# EAGLE schematic GuitarTuner (EAGLE 9.6.2)
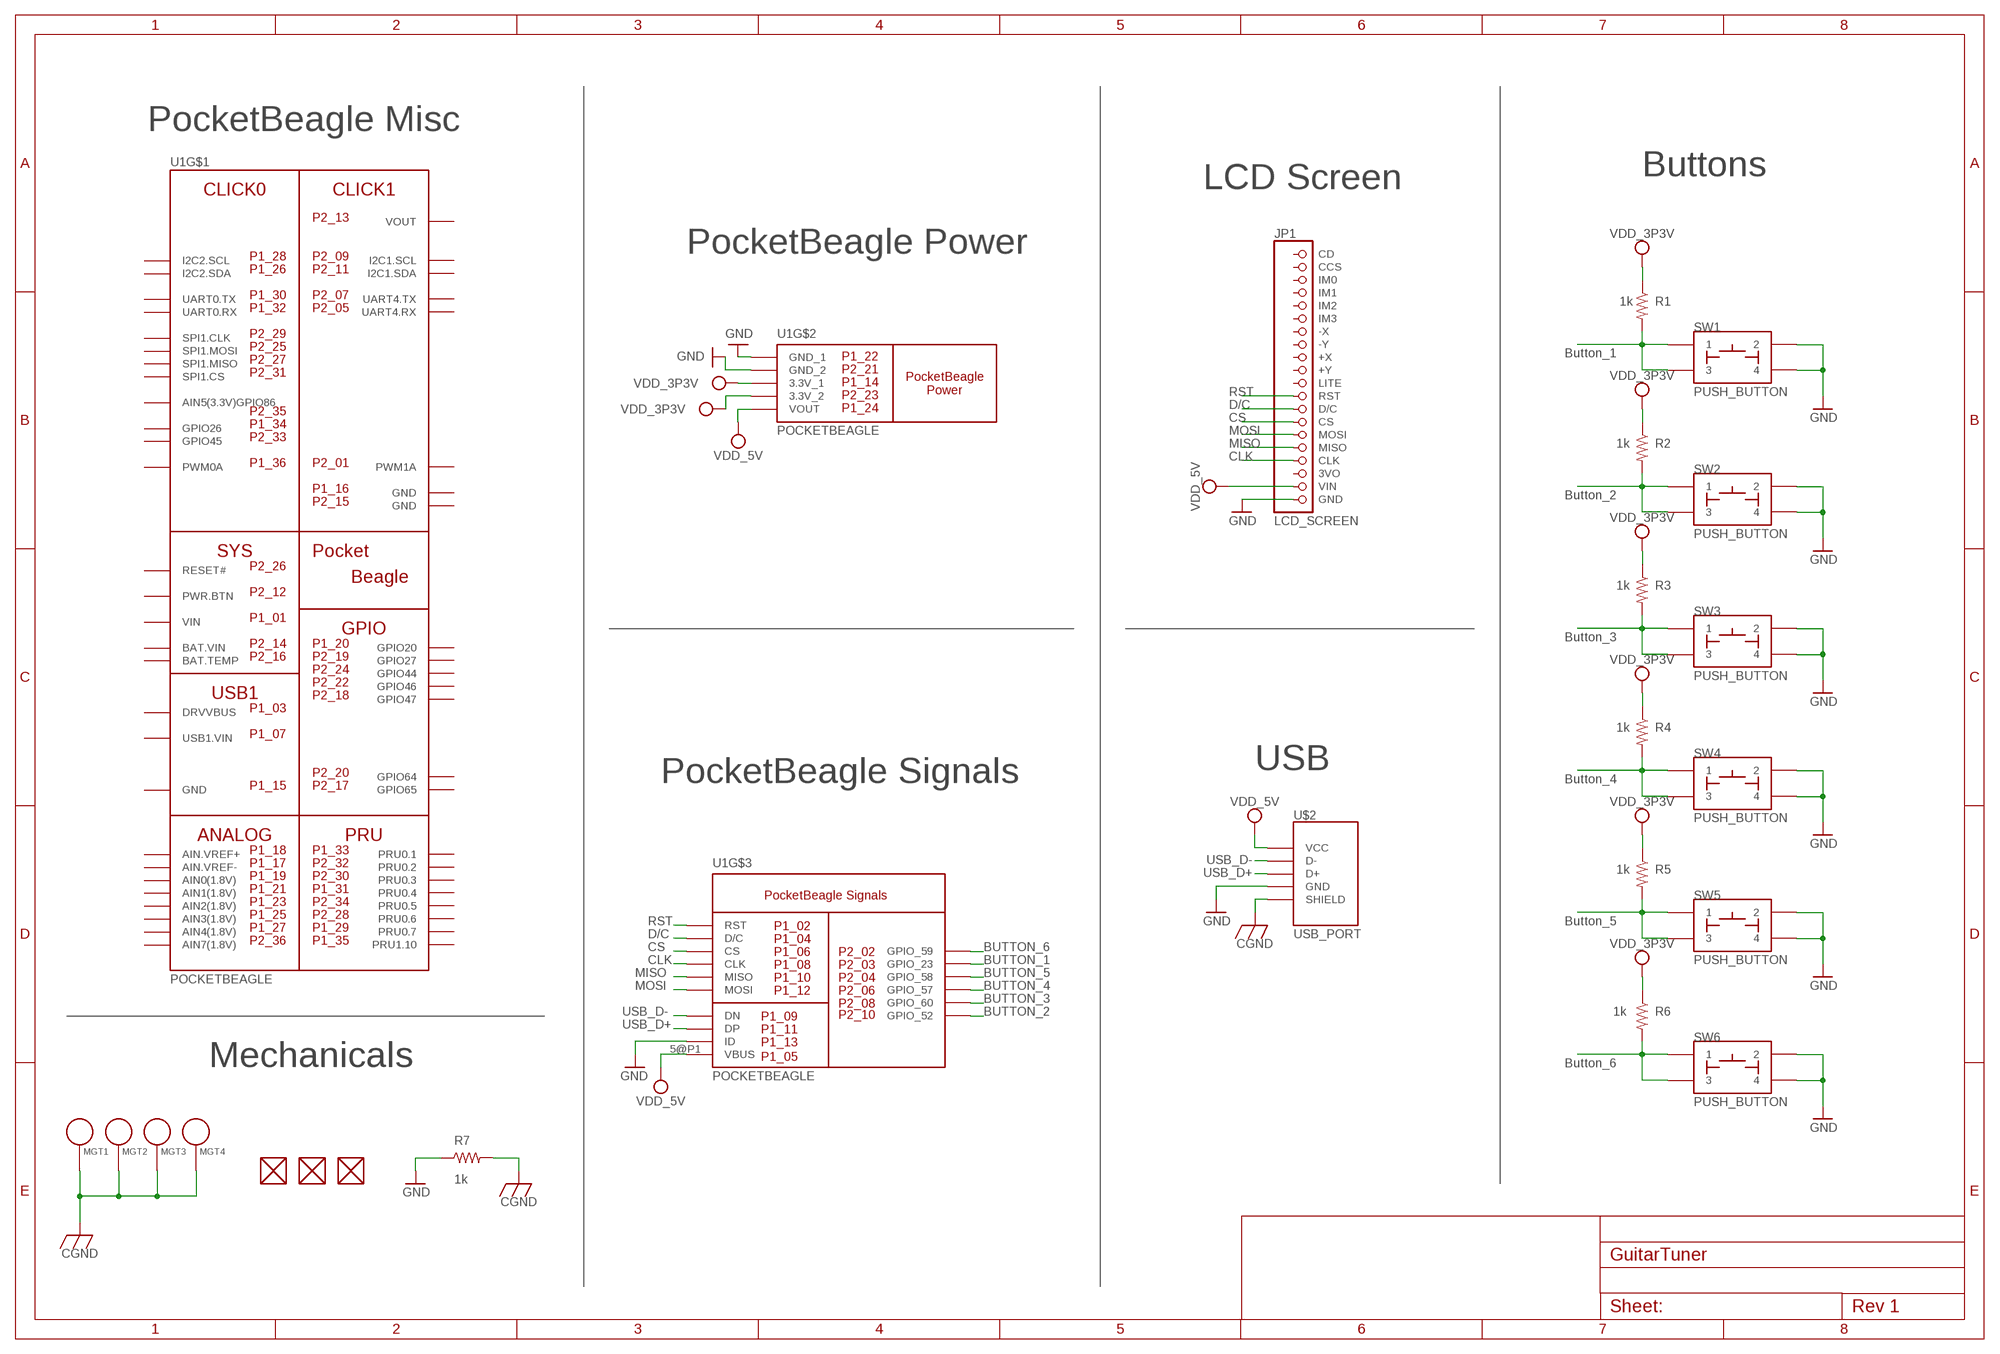
[diagram p0: schematic, sheet 1]

## Parts
FUD1  FIDUCIAL  [FIDUCIAL_40MIL]
FUD2  FIDUCIAL  [FIDUCIAL_40MIL]
FUD3  FIDUCIAL  [FIDUCIAL_40MIL]
JP1  LCD_SCREEN  HEADER-1X20ROUND  [1X20_ROUND]
MGT1  MOUNTING_HOLE  [MOUNTING_HOLE]
MGT2  MOUNTING_HOLE  [MOUNTING_HOLE]
MGT3  MOUNTING_HOLE  [MOUNTING_HOLE]
MGT4  MOUNTING_HOLE  [MOUNTING_HOLE]
R1  1k  R_R0603  [R0603]
R2  1k  R_R0603  [R0603]
R3  1k  R_R0603  [R0603]
R4  1k  R_R0603  [R0603]
R5  1k  R_R0603  [R0603]
R6  1k  R_R0603  [R0603]
R7  1k  R_R0805  [R0805]
SW1  PUSH_BUTTON  [BUTTON_12.5MM]
SW2  PUSH_BUTTON  [BUTTON_12.5MM]
SW3  PUSH_BUTTON  [BUTTON_12.5MM]
SW4  PUSH_BUTTON  [BUTTON_12.5MM]
SW5  PUSH_BUTTON  [BUTTON_12.5MM]
SW6  PUSH_BUTTON  [BUTTON_12.5MM]
U1  POCKETBEAGLE  [POCKETBEAGLE]
U$2  USB_PORT  [USB_PORT]

## Nets
BUTTON_1: R1.2 SW1.1 SW1.3 U1.3@P2(GPIO_23)
BUTTON_2: R2.2 SW2.1 SW2.3 U1.10@P2(GPIO_52)
BUTTON_3: R3.2 SW3.1 SW3.3 U1.8@P2(GPIO_60)
BUTTON_4: R4.2 SW4.1 SW4.3 U1.6@P2(GPIO_57)
BUTTON_5: R5.2 SW5.1 SW5.3 U1.4@P2(GPIO_58)
BUTTON_6: R6.2 SW6.1 SW6.3 U1.2@P2(GPIO_59)
CGND: MGT1.P$1 MGT2.P$1 MGT3.P$1 MGT4.P$1 R7.2 U$2.SH1(SHIELD) U$2.SH2(SHIELD)
CLK: JP1.17(CLK) U1.8@P1(CLK)
CS: JP1.14(CS) U1.6@P1(CS)
D/C: JP1.13(D/C) U1.4@P1(D/C)
GND: JP1.20(GND) R7.1 SW1.2 SW1.4 SW2.2 SW2.4 SW3.2 SW3.4 SW4.2 SW4.4 SW5.2 SW5.4 SW6.2 SW6.4 U1.13@P1(ID) U1.21@P2(GND_2) U1.22@P1(GND_1) U$2.4(GND)
MISO: JP1.16(MISO) U1.10@P1(MISO)
MOSI: JP1.15(MOSI) U1.12@P1(MOSI)
RST: JP1.12(RST) U1.1@P2(RST)
USB_D+: U1.11@P1(DP) U$2.3(D+)
USB_D-: U1.9@P1(DN) U$2.2(D-)
VDD_3P3V: R1.1 R2.1 R3.1 R4.1 R5.1 R6.1 U1.14@P1(3.3V_1) U1.23@P2(3.3V_2)
VDD_5V: JP1.19(VIN) U1.5@P1(VBUS) U1.24@P1(VOUT) U$2.1(VCC)
Unconnected: FUD1.P$1 FUD2.P$1 FUD3.P$1 JP1.1(CD) JP1.2(CCS) JP1.3(IM0) JP1.4(IM1) JP1.5(IM2) JP1.6(IM3) JP1.7(-X) JP1.8(-Y) JP1.9(+X) JP1.10(+Y) JP1.11(LITE) JP1.18(3VO) U1.1@P1(PWM1A) U1.3@P1(DRVVBUS) U1.5@P2(UART4.RX) U1.7@P1(USB1.VIN) U1.7@P2(UART4.TX) U1.9@P2(I2C1.SCL) U1.11@P2(I2C1.SDA) U1.12@P2(PWR.BTN) U1.15@P1(GND) U1.16@P2(BAT.TEMP) U1.17@P1(AIN.VREF-) U1.17@P2(GPIO65) U1.18@P1(AIN.VREF+) U1.18@P2(GPIO47) U1.19@P1(AIN0(1.8V)) U1.19@P2(GPIO27) U1.20@P1(GPIO20) U1.20@P2(GPIO64) U1.21@P1(AIN1(1.8V)) U1.22@P2(GPIO46) U1.23@P1(AIN2(1.8V)) U1.24@P2(GPIO44) U1.25@P1(AIN3(1.8V)) U1.25@P2(SPI1.MOSI) U1.26@P1(I2C2.SDA) U1.26@P2(RESET#) U1.27@P1(AIN4(1.8V)) U1.27@P2(SPI1.MISO) U1.28@P1(I2C2.SCL) U1.28@P2(PRU0.6) U1.29@P1(PRU0.7) U1.29@P2(SPI1.CLK) U1.30@P1(UART0.TX) U1.30@P2(PRU0.3) U1.31@P1(PRU0.4) U1.31@P2(SPI1.CS) U1.32@P1(UART0.RX) U1.32@P2(PRU0.2) U1.33@P1(PRU0.1) U1.33@P2(GPIO45) U1.34@P1(GPIO26) U1.34@P2(PRU0.5) U1.35@P1(PRU1.10) U1.35@P2(AIN5(3.3V)GPIO86) U1.36@P1(PWM0A) U1.36@P2(AIN7(1.8V))

## Notes on the sheet
- PocketBeagle Misc
- Buttons
- LCD Screen
- PocketBeagle Power
- Button_1
- Button_2
- Button_3
- USB
- PocketBeagle Signals | Button_4
- USB_D-
- USB_D+
- Button_5
- Mechanicals | Button_6

## Power pins joined to a net without a drawn wire
BAT.VIN: U1.14@P2(BAT.VIN)
GND: U1.15@P2(GND) U1.16@P1(GND)
VIN: U1.2@P1(VIN)
VOUT: U1.13@P2(VOUT)

## Library data of the parts
FUD1-FUD3 = GuitarTuner:FIDUCIAL
JP1 = GuitarTuner:HEADER-1X20
MGT1-MGT4 = GuitarTuner:MOUNTING_HOLE: Chassis Mounting Hole w/GND connection ability
R1-R7 = GuitarTuner:R_: RESISTOR, American symbol
SW1-SW6 = GuitarTuner:PUSH_BUTTON
U1 = GuitarTuner:POCKETBEAGLE
U$2 = GuitarTuner:USB_PORT